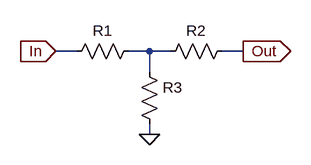
[diagram p0: schematic redT.asc]
redT.asc, the LTspice schematic file:
Version 4.1
SHEET 1 880 680
WIRE 0 128 -32 128
WIRE 112 128 80 128
WIRE 144 128 112 128
WIRE 256 128 224 128
WIRE 112 160 112 128
WIRE 112 256 112 240
FLAG 112 256 0
FLAG -32 128 In
IOPIN -32 128 In
FLAG 256 128 Out
IOPIN 256 128 Out
SYMBOL res 96 144 R0
SYMATTR InstName R3
SYMATTR Value ""
SYMBOL res 96 112 R90
WINDOW 0 0 56 VBottom 2
WINDOW 3 32 56 VTop 2
SYMATTR InstName R1
SYMATTR Value ""
SYMBOL res 240 112 R90
WINDOW 0 0 56 VBottom 2
WINDOW 3 32 56 VTop 2
SYMATTR InstName R2
SYMATTR Value ""

The netlist it stands for:
* redT.asc
R3 N001 0
R1 N001 In
R2 Out N001
.backanno
.end